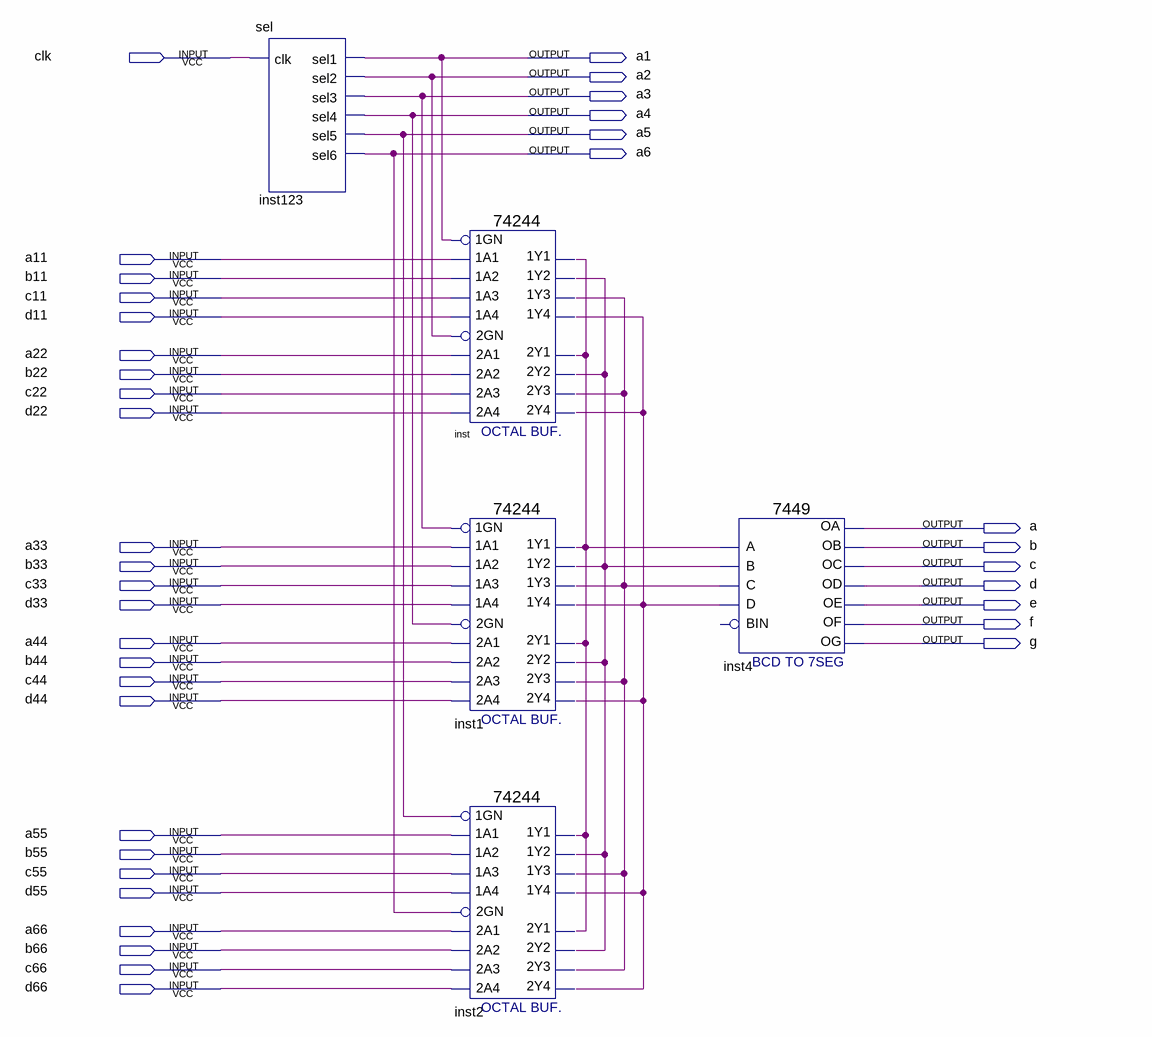
[diagram p0: schematic sheet]
// Quartus schematic display.bdf as structural Verilog: 5 symbols, 38 pins
module display (
  input  clk,
  input  a11,
  input  b11,
  input  c11,
  input  d11,
  input  a22,
  input  b22,
  input  c22,
  input  d22,
  input  a33,
  input  b33,
  input  c33,
  input  d33,
  input  a44,
  input  b44,
  input  c44,
  input  d44,
  input  a55,
  input  b55,
  input  c55,
  input  d55,
  input  a66,
  input  b66,
  input  c66,
  input  d66,
  output a1,
  output a2,
  output a3,
  output a4,
  output a5,
  output a6,
  output a,
  output b,
  output c,
  output d,
  output e,
  output f,
  output g
);

  wire inst_1y2, inst_1y4, inst_2y1, inst_2y3;

  sel inst123 (.clk(clk), .sel1(a1), .sel2(a2), .sel3(a3), .sel4(a4), .sel5(a5), .sel6(a6));
  \74244  inst (
    .\1A2 (b11), .\1A4 (d11), .\1A1 (a11), .\1A3 (c11), .\1GN (a1), .\2A3 (c22), .\2GN (a2), .\2A1 (a22),
    .\2A4 (d22), .\2A2 (b22), .\1Y2 (inst_1y2), .\1Y4 (inst_1y4), .\2Y1 (inst_2y1), .\1Y1 (inst_2y1),
    .\2Y3 (inst_2y3), .\2Y4 (inst_1y4), .\1Y3 (inst_2y3), .\2Y2 (inst_1y2));
  \74244  inst1 (
    .\1A2 (b33), .\1A4 (d33), .\1A1 (a33), .\1A3 (c33), .\1GN (a3), .\2A3 (c44), .\2GN (a4), .\2A1 (a44),
    .\2A4 (d44), .\2A2 (b44), .\1Y2 (inst_1y2), .\1Y4 (inst_1y4), .\2Y1 (inst_2y1), .\1Y1 (inst_2y1),
    .\2Y3 (inst_2y3), .\2Y4 (inst_1y4), .\1Y3 (inst_2y3), .\2Y2 (inst_1y2));
  \74244  inst2 (
    .\1A2 (b55), .\1A4 (d55), .\1A1 (a55), .\1A3 (c55), .\1GN (a5), .\2A3 (c66), .\2GN (a6), .\2A1 (a66),
    .\2A4 (d66), .\2A2 (b66), .\1Y2 (inst_1y2), .\1Y4 (inst_1y4), .\2Y1 (inst_2y1), .\1Y1 (inst_2y1),
    .\2Y3 (inst_2y3), .\2Y4 (inst_1y4), .\1Y3 (inst_2y3), .\2Y2 (inst_1y2));
  \7449  inst4 (
    .A(inst_2y1), .C(inst_2y3), .B(inst_1y2), .D(inst_1y4), .OC(c), .OD(d), .OF(f), .OG(g), .OB(b), .OA(a),
    .OE(e));  // open: BIN
endmodule
